# Altium project BLE.PrjPcb
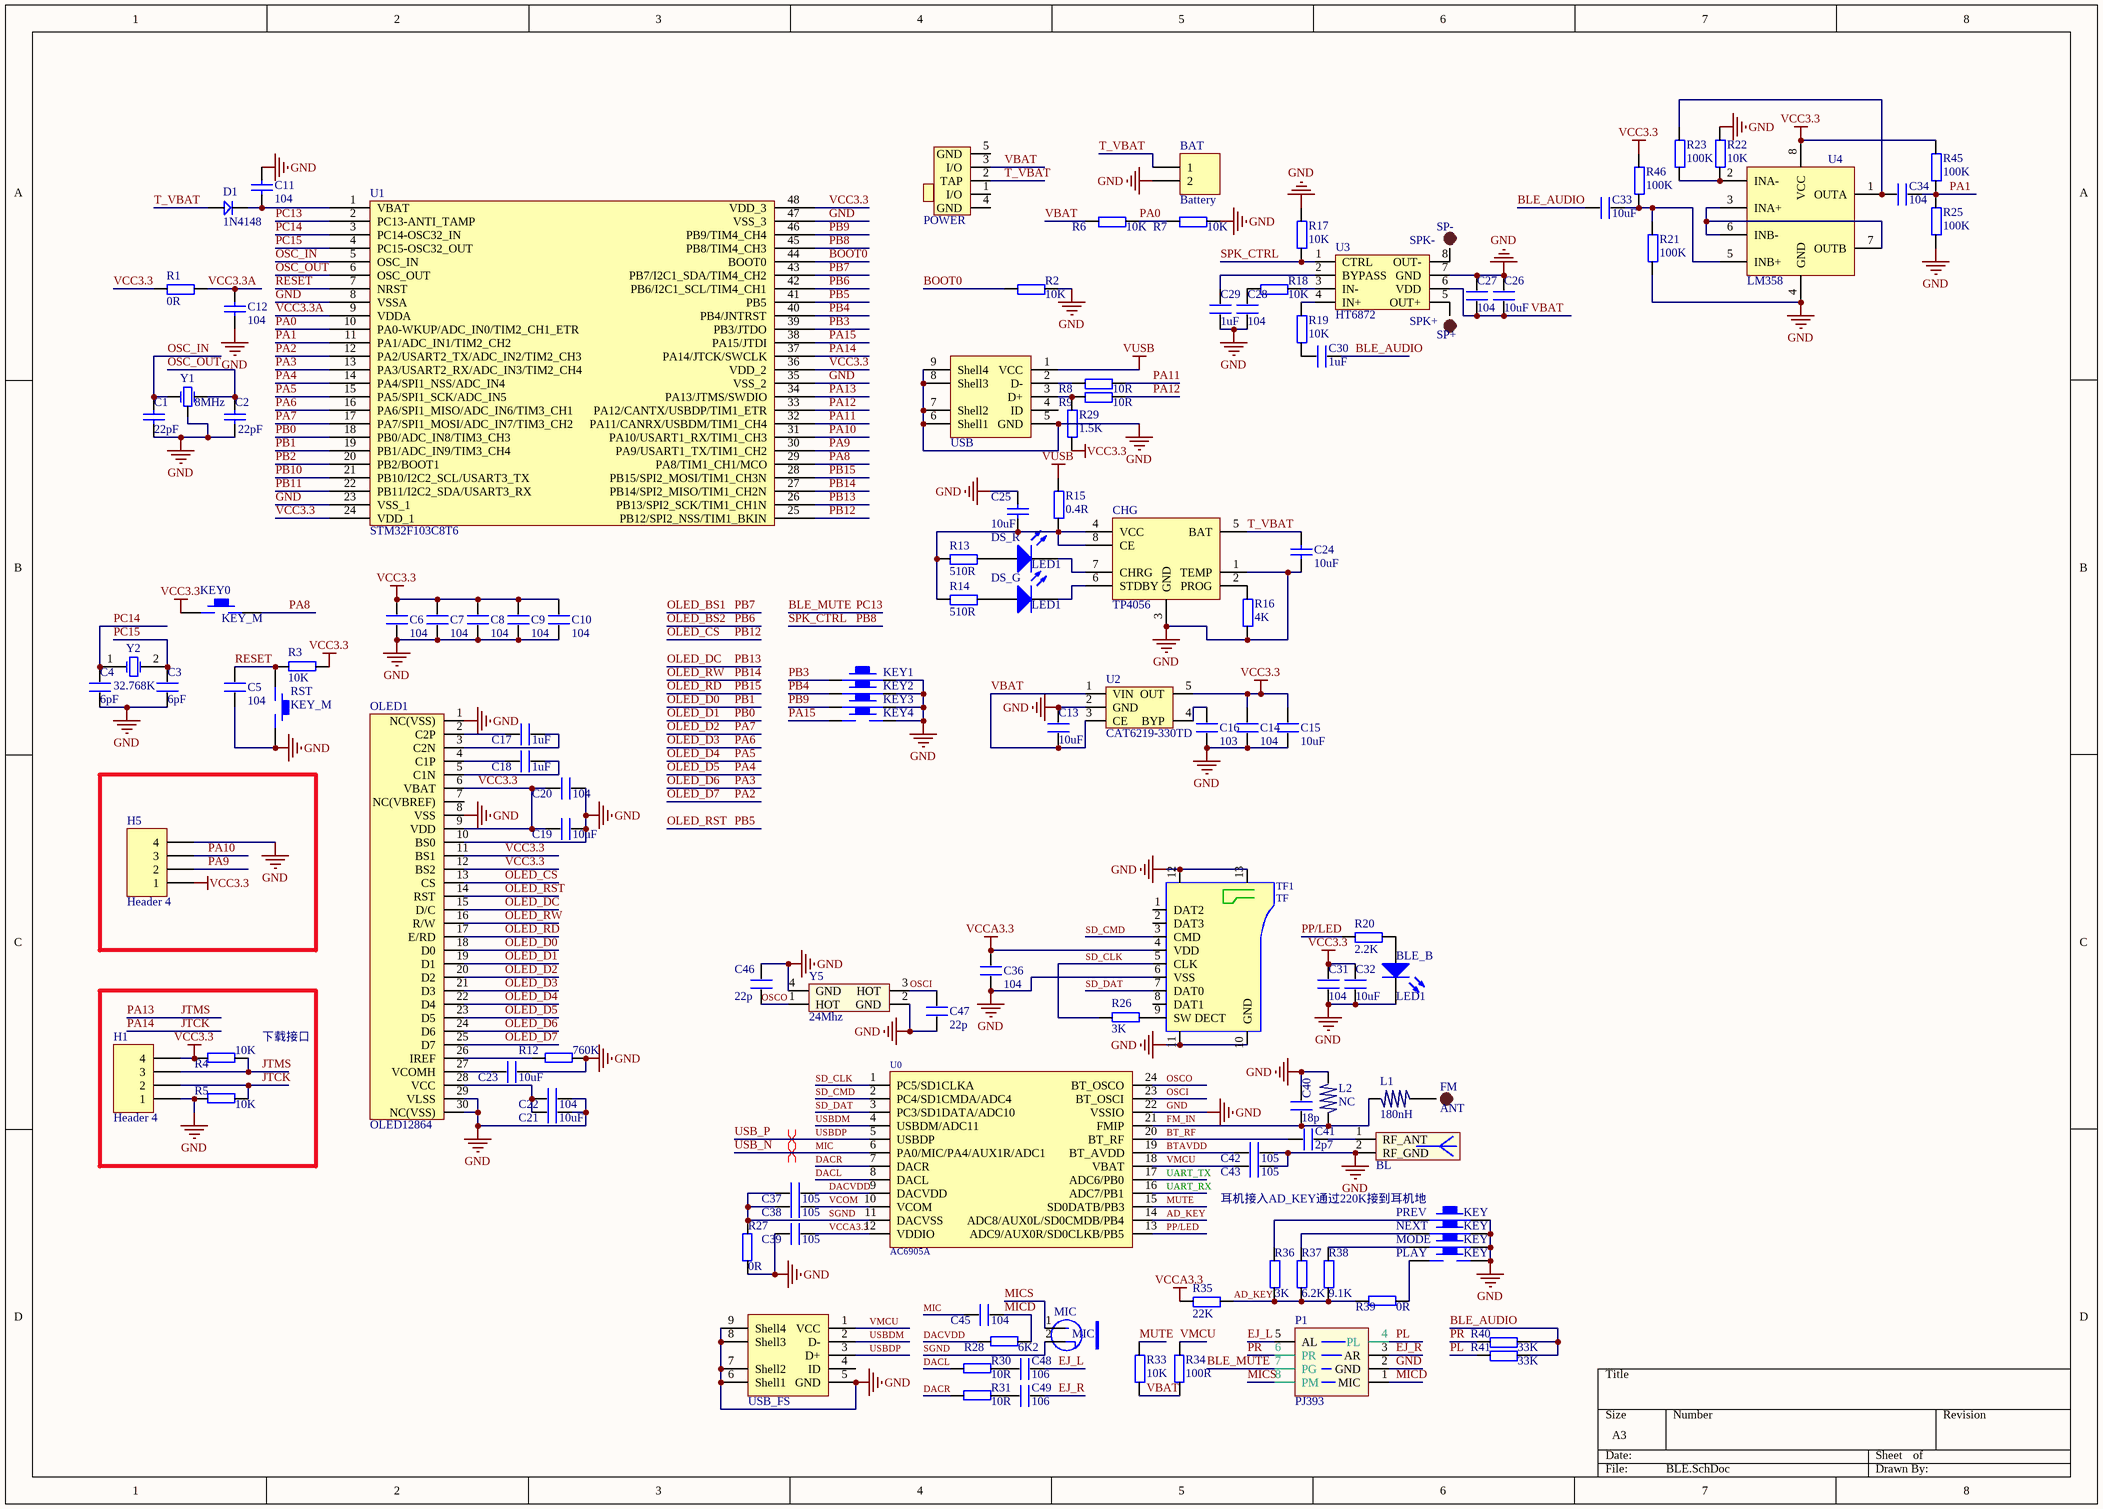
[diagram p0: BLE.SchDoc]
1 sheet, 125 parts. Net scope: global (net labels, ports and power ports of the same name join across sheets).
Board files: BLE.PcbDoc, Github_Logo.PcbDoc

## Sheet BLE.SchDoc
size A3

### Parts
BAT  Battery  [HDR2.54-LI-2P]
BL  ANT-2.4G  [BT_ANT]  (value not drawn)
BLE_B  LED1  [LED 0805B]
C1  22pF  [C 0603_M]
C2  22pF  [C 0603_M]
C3  6pF  [C 0603_M]
C4  6pF  [C 0603_M]
C5  104  [C 0603_M]
C6  104  [C 0603_M]
C7  104  [C 0603_M]
C8  104  [C 0603_M]
C9  104  [C 0603_M]
C10  104  [C 0603_M]
C11  104  [C 0603_M]
C12  104  [C 0603_M]
C13  10uF  [C 0603_M]
C14  104  [C 0603_M]
C15  10uF  [C 0603_M]
C16  103  [C 0603_M]
C17  1uF  [C 0603_M]
C18  1uF  [C 0603_M]
C19  10uF  [C 0603_M]
C20  104  [C 0603_M]
C21  10uF  [C 0603_M]
C22  104  [C 0603_M]
C23  10uF  [C 0603_M]
C24  10uF  [C 0603_M]
C25  10uF  [C 0603_M]
C26  10uF  [C 0603_M]
C27  104  [C 0603_M]
C28  104  [C 0603_M]
C29  1uF  [C 0603_M]
C30  1uF  [C 0603_M]
C31  104  [C 0603_M]
C32  10uF  [C 0603_M]
C33  10uF  [C 0603_M]
C34  104  [C 0603_M]
C36  104  [C 0603_M]
C37  105  [C 0603_M]
C38  105  [C 0603_M]
C39  105  [C 0603_M]
C40  18p  [C 0603_M]
C41  2p7  [C 0603_M]
C42  105  [C 0603_M]
C43  105  [C 0603_M]
C45  104  [C 0603_M]
C46  22p  [C 0603_M]
C47  22p  [C 0603_M]
C48  106  [C 0603_M]
C49  106  [C 0603_M]
CHG  TP4056  [SOP8_M]
D1  1N4148  [DIODE_SOP]
DS_G  LED1  [LED 0805G]
DS_R  LED1  [LED 0805R]
FM  ANT  [TP-1.5]
H1  Header 4  [HDR2.54-LI-4P]
H5  Header 4  [HDR2.54-LI-4P]
KEY0  KEY_M  [TSW SMD-3*6*2.5]
KEY1  S-KEY-SMD-324225  [KEY-SOP324225]  (value not drawn)
KEY2  S-KEY-SMD-324225  [KEY-SOP324225]  (value not drawn)
KEY3  S-KEY-SMD-324225  [KEY-SOP324225]  (value not drawn)
KEY4  S-KEY-SMD-324225  [KEY-SOP324225]  (value not drawn)
L1  180nH  [L 0603]
L2  NC  [L 0603]
MIC  MIC  [mic6022]
MODE  KEY  [TSW SMD-3*6*2.5]
NEXT  KEY  [TSW SMD-3*6*2.5]
OLED1  OLED12864  [OLED_0.96]
P1  PJ393  [PJ393]
PLAY  KEY  [TSW SMD-3*6*2.5]
POWER  BUTTON_DIP3  [MSK-12C01-07]  (value not drawn)
PREV  KEY  [TSW SMD-3*6*2.5]
R1  0R  [R 0603_M]
R2  10K  [R 0603_M]
R3  10K  [R 0603_M]
R4  10K  [R 0603_M]
R5  10K  [R 0603_M]
R6  10K  [R 0603_M]
R7  10K  [R 0603_M]
R8  10R  [R 0603_M]
R9  10R  [R 0603_M]
R12  760K  [R 0603_M]
R13  510R  [R 0603_M]
R14  510R  [R 0603_M]
R15  0.4R  [R 0603_M]
R16  4K  [R 0603_M]
R17  10K  [R 0603_M]
R18  10K  [R 0603_M]
R19  10K  [R 0603_M]
R20  2.2K  [R 0603_M]
R21  100K  [R 0603_M]
R22  10K  [R 0603_M]
R23  100K  [R 0603_M]
R25  100K  [R 0603_M]
R26  3K  [R 0603_M]
R27  0R  [R 0603_M]
R28  6K2  [R 0603_M]
R29  1.5K  [R 0603_M]
R30  10R  [R 0603_M]
R31  10R  [R 0603_M]
R33  10K  [R 0603_M]
R34  100R  [R 0603_M]
R35  22K  [R 0603_M]
R36  3K  [R 0603_M]
R37  6.2K  [R 0603_M]
R38  9.1K  [R 0603_M]
R39  0R  [R 0603_M]
R40  33K  [R 0603_M]
R41  33K  [R 0603_M]
R45  100K  [R 0603_M]
R46  100K  [R 0603_M]
RST  KEY_M  [TSW SMD-3*6*2.5]
SP+  SPK+  [TP-1.5]
SP-  SPK-  [TP-1.5]
TF1  TF  [TF]
U0  AC6905A  [SSOP24]
U1  STM32F103C8T6  [LQFP-48PIN]
U2  CAT6219-330TD  [SOT23-5L]
U3  HT6872  [SOP8_M]
U4  LM358  [SOP8_M]
USB  J-MICRO-USB-5S  [USB-AB-5S]  (value not drawn)
USB_FS  J-MICRO-USB-5S  [USB-AB-5S]  (value not drawn)
Y1  8MHz  [Y-XTAL-3215-3P]
Y2  32.768K  [OSC 3215-2P]
Y5  24Mhz  [OSC 3225-4P]

### Blocks framed on the sheet
下载接口: H1 R4 R5

### Nets
GND: BAT.2 BL.2(RF_GND) BLE_B.2(K) C1.1 C2.1 C3.1 C4.1 C5.1 C6.1 C7.1 C8.1 C9.1 C10.1 C11.2 C12.1 C13.2 C14.1 C15.1 C16.1 C19.1 C20.1 C21.1 C22.1 C23.1 C24.2 C25.2 C26.2 C27.2 C28.1 C29.1 C31.1 C32.1 C36.1 C39.2 C40.1 C42.2 C43.2 C46.1 C47.1 CHG.1(TEMP) CHG.3(GND) H1.1 H5.4 KEY1.2 KEY2.2 KEY3.2 KEY4.2 L2.1 MODE.2 NEXT.2 OLED1.1(NC(VSS)) OLED1.8(VSS) OLED1.10(BS0) OLED1.29(VLSS) OLED1.30(NC(VSS)) P1.2(GND) PLAY.2 PREV.2 R2.2 R5.2 R7.2 R12.1 R16.1 R17.2 R21.1 R22.2 R25.1 R27.2 RST.2 TF1.6(VSS) TF1.10(GND) TF1.11 TF1.12 TF1.13 U0.22(VSSIO) U1.8(VSSA) U1.23(VSS_1) U1.35(VSS_2) U1.47(VSS_3) U2.2(GND) U3.7(GND) U4.4(GND) USB.5(GND) USB.6(Shell1) USB.7(Shell2) USB.8(Shell3) USB.9(Shell4) USB_FS.5(GND) USB_FS.6(Shell1) USB_FS.7(Shell2) USB_FS.8(Shell3) USB_FS.9(Shell4) Y1.2(GND) Y5.2(GND) Y5.4(GND)
VCC3.3: C6.2 C7.2 C8.2 C9.2 C10.2 C14.2 C15.2 C19.2 C20.2 C31.2 C32.2 H1.4 H5.1 KEY0.1 OLED1.6(VBAT) OLED1.9(VDD) OLED1.11(BS1) OLED1.12(BS2) R1.1 R3.1 R4.2 R29.1 R45.2 R46.2 U1.24(VDD_1) U1.36(VDD_2) U1.48(VDD_3) U2.5(OUT) U4.8(VCC)
VCCA3.3: C36.2 C39.1 R35.1 TF1.4(VDD) U0.12(VDDIO)
VUSB: R15.2 USB.1(VCC)
AD_KEY: R35.2 R36.1 R37.1 R38.1 R39.2 U0.14(ADC8/AUX0L/SD0CMDB/PB4)
BLE_AUDIO: C30.2 C33.1 R40.2 R41.2
BLE_MUTE: P1.7(PG) U1.2(PC13-ANTI_TAMP)  [also labelled PC13]
BOOT0: R2.1 U1.44(BOOT0)
BT_RF: C41.1 U0.20(BT_RF)
BTAVDD: C42.1 U0.19(BT_AVDD)
DACL: R30.2 U0.8(DACL)
DACR: R31.2 U0.7(DACR)
DACVDD: C37.1 R28.2 U0.9(DACVDD)
EJ_L: C48.2 P1.5(AL)
EJ_R: C49.2 P1.3(AR)
FM_IN: C40.2 L1.1 L2.2 U0.21(FMIP)
JTCK: H1.2 R5.1 U1.37(PA14/JTCK/SWCLK)  [also labelled PA14]
JTMS: H1.3 R4.1 U1.34(PA13/JTMS/SWDIO)  [also labelled PA13]
MIC: C45.1 U0.6(PA0/MIC/PA4/AUX1R/ADC1)  [also labelled USB_N]
MICD: C45.2 P1.1(MIC) R28.1
MICS: MIC.1(VCC) P1.8(PM)
MUTE: R33.2 U0.15(SD0DATB/PB3)
OLED_BS1: U1.43(PB7/I2C1_SDA/TIM4_CH2)  [also labelled PB7]
OLED_BS2: U1.42(PB6/I2C1_SCL/TIM4_CH1)  [also labelled PB6]
OLED_CS: OLED1.13(CS) U1.25(PB12/SPI2_NSS/TIM1_BKIN)  [also labelled PB12]
OLED_D0: OLED1.18(D0) U1.19(PB1/ADC_IN9/TIM3_CH4)  [also labelled PB1]
OLED_D1: OLED1.19(D1) U1.18(PB0/ADC_IN8/TIM3_CH3)  [also labelled PB0]
OLED_D2: OLED1.20(D2) U1.17(PA7/SPI1_MOSI/ADC_IN7/TIM3_CH2)  [also labelled PA7]
OLED_D3: OLED1.21(D3) U1.16(PA6/SPI1_MISO/ADC_IN6/TIM3_CH1)  [also labelled PA6]
OLED_D4: OLED1.22(D4) U1.15(PA5/SPI1_SCK/ADC_IN5)  [also labelled PA5]
OLED_D5: OLED1.23(D5) U1.14(PA4/SPI1_NSS/ADC_IN4)  [also labelled PA4]
OLED_D6: OLED1.24(D6) U1.13(PA3/USART2_RX/ADC_IN3/TIM2_CH4)  [also labelled PA3]
OLED_D7: OLED1.25(D7) U1.12(PA2/USART2_TX/ADC_IN2/TIM2_CH3)  [also labelled PA2]
OLED_DC: OLED1.15(D/C) U1.26(PB13/SPI2_SCK/TIM1_CH1N)  [also labelled PB13]
OLED_RD: OLED1.17(E/RD) U1.28(PB15/SPI2_MOSI/TIM1_CH3N)  [also labelled PB15]
OLED_RST: OLED1.14(RST) U1.41(PB5)  [also labelled PB5]
OLED_RW: OLED1.16(R/W) U1.27(PB14/SPI2_MISO/TIM1_CH2N)  [also labelled PB14]
OSC_IN: C1.2 U1.5(OSC_IN) Y1.1(OSC1)
OSC_OUT: C2.2 U1.6(OSC_OUT) Y1.3(OSC2)
OSCI: C47.2 U0.23(BT_OSCI) Y5.3(HOT)
OSCO: C46.2 U0.24(BT_OSCO) Y5.1(HOT)
PA0: R6.2 R7.1 U1.10(PA0-WKUP/ADC_IN0/TIM2_CH1_ETR)
PA1: C34.2 R25.2 R45.1 U1.11(PA1/ADC_IN1/TIM2_CH2)
PA8: KEY0.2 U1.29(PA8/TIM1_CH1/MCO)
PA9: H5.2 U1.30(PA9/USART1_TX/TIM1_CH2)
PA10: H5.3 U1.31(PA10/USART1_RX/TIM1_CH3)
PA11: R8.2 U1.32(PA11/CANRX/USBDM/TIM1_CH4)
PA12: R9.2 U1.33(PA12/CANTX/USBDP/TIM1_ETR)
PA15: KEY4.1 U1.38(PA15/JTDI)
PB2: U1.20(PB2/BOOT1)
PB3: KEY1.1 U1.39(PB3/JTDO)
PB4: KEY2.1 U1.40(PB4/JNTRST)
PB8: R17.1 U1.45(PB8/TIM4_CH3) U3.1(CTRL)  [also labelled SPK_CTRL]
PB9: KEY3.1 U1.46(PB9/TIM4_CH4)
PB10: U1.21(PB10/I2C2_SCL/USART3_TX)
PB11: U1.22(PB11/I2C2_SDA/USART3_RX)
PC14: C4.2 U1.3(PC14-OSC32_IN) Y2.1(OSC1)
PC15: C3.2 U1.4(PC15-OSC32_OUT) Y2.2(OSC2)
PL: P1.4(PL) R41.1
PP/LED: R20.1 U0.13(ADC9/AUX0R/SD0CLKB/PB5)
PR: P1.6(PR) R40.1
RESET: C5.2 R3.2 RST.1 U1.7(NRST)
SD_CLK: R26.2 TF1.5(CLK) U0.1(PC5/SD1CLKA)
SD_CMD: TF1.3(CMD) U0.2(PC4/SD1CMDA/ADC4)
SD_DAT: TF1.7(DAT0) U0.3(PC3/SD1DATA/ADC10)
SGND: C37.2 C38.2 MIC.2(GND) R27.1 U0.11(DACVSS)
T_VBAT: BAT.1 C24.1 CHG.5(BAT) D1.1 POWER.2(TAP)
UART_RX: U0.16(ADC7/PB1)
UART_TX: U0.17(ADC6/PB0)
USB_P: U0.5(USBDP) USB_FS.3(D+)  [also labelled USBDP]
USBDM: U0.4(USBDM/ADC11) USB_FS.2(D-)
VBAT: C13.1 C26.1 C27.1 POWER.3(I/O) R6.1 R33.1 R34.2 U2.1(VIN) U2.3(CE) U3.6(VDD)
VCC3.3A: C12.2 R1.2 U1.9(VDDA)
VCOM: C38.1 U0.10(VCOM)
VMCU: C43.1 R34.1 U0.18(VBAT) USB_FS.1(VCC)
NetBL_1: BL.1(RF_ANT) C41.2
NetBLE_B_1: BLE_B.1(A) R20.2
NetC11_1: C11.1 D1.2 U1.1(VBAT)
NetC16_2: C16.2 U2.4(BYP)
NetC17_1: C17.1 OLED1.3(C2N)
NetC17_2: C17.2 OLED1.2(C2P)
NetC18_1: C18.1 OLED1.5(C1N)
NetC18_2: C18.2 OLED1.4(C1P)
NetC21_2: C21.2 C22.2 OLED1.28(VCC)
NetC23_2: C23.2 OLED1.27(VCOMH)
NetC25_1: C25.1 CHG.4(VCC) CHG.8(CE) R13.1 R14.1 R15.1
NetC28_2: C28.2 R18.1
NetC29_2: C29.2 U3.2(BYPASS)
NetC30_1: C30.1 R19.1
NetC33_2: C33.2 R21.2 R46.1 U4.5(INB+)
NetC34_1: C34.1 R23.2 U4.1(OUTA)
NetC48_1: C48.1 R30.1
NetC49_1: C49.1 R31.1
NetCHG_2: CHG.2(PROG) R16.2
NetCHG_6: CHG.6(STDBY) DS_G.2(K)
NetCHG_7: CHG.7(CHRG) DS_R.2(K)
NetDS_G_1: DS_G.1(A) R14.2
NetDS_R_1: DS_R.1(A) R13.2
NetFM_1: FM.1 L1.2
NetMODE_1: MODE.1 R38.2
NetNEXT_1: NEXT.1 R37.2
NetOLED1_26: OLED1.26(IREF) R12.2
NetPLAY_1: PLAY.1 R39.1
NetPREV_1: PREV.1 R36.2
NetR8_1: R8.1 USB.2(D-)
NetR9_1: R9.1 R29.2 USB.3(D+)
NetR18_2: R18.2 U3.3(IN-)
NetR19_2: R19.2 U3.4(IN+)
NetR22_1: R22.1 R23.1 U4.2(INA-)
NetR26_1: R26.1 TF1.9(SW_DECT)
NetSP+_1: SP+.1 U3.5(OUT+)
NetSP-_1: SP-.1 U3.8(OUT-)
NetU4_3: U4.3(INA+) U4.6(INB-) U4.7(OUTB)

Not connected (* = marked no-connect by the designer): OLED1 7(NC(VBREF)); POWER 1(I/O) 4(GND) 5(GND); TF1 1(DAT2) 2(DAT3) 8(DAT1); USB 4(ID); USB_FS 4(ID)

### Layout directives
differential pair: MIC, USB_P

### Notes on the sheet
- 耳机接入AD_KEY通过220K接到耳机地

### Library data of the parts
BAT = Header 2: Header, 2-Pin; LatestRevisionDate: 17-Jul-2002; LatestRevisionNote: Re-released for DXP Platform.; Publisher: Altium Limited
BL = ANT-2.4G: ANT,2.4G,PCB天线
BLE_B DS_G DS_R = LED2: Typical RED, GREEN, YELLOW, AMBER GaAs LED; Published: 8-Jun-2000; LatestRevisionDate: 17-Jul-2002; LatestRevisionNote: Re-released for DXP Platform.; PackageDocument: Feb-2002; PackageReference: 3.2X1.6X1.1; Publisher: Altium Limited
C1 C2 C11 C12 C24 C25 = CAP
C3-C10 C13-C23 C26-C34 C36-C43 C45-C49 = C
CHG = Component_1
D1 = D
FM SP+ SP- = TEST-POINT: 测试点
H1 H5 = Header 4: Header, 4-Pin; LatestRevisionDate: 17-Jul-2002; LatestRevisionNote: Re-released for DXP Platform.; Publisher: Altium Limited
KEY1-KEY4 = S-KEY-SMD-324225: KEY,SMD,324225
L1 L2 = L
MODE NEXT PLAY PREV = KEY_M
POWER = BUTTON_DIP3: 拨动开关SS-12F44
R1-R9 R12-R23 R25-R31 R33-R41 R45 R46 = R
U0 = Component_1_1
U1 = U-STM32F103C8T6
U2 = CAT6219-330TD: 3.3V 500mA LDO
U3 = HT6871
U4 = Component_2
USB USB_FS = J-MICRO-USB-5S: Micro USB 5.9有柱脚长1.25加长针
Y1 = Y-3215-8M: XTAL,3215,8MHz
Y2 = XTAL: Crystal Oscillator; Published: 8-Jun-2000; LatestRevisionDate: 17-Jul-2002; LatestRevisionNote: Re-released for DXP Platform.; Publisher: Altium Limited
Y5 = XTAL_3225: 3225贴片无源晶振